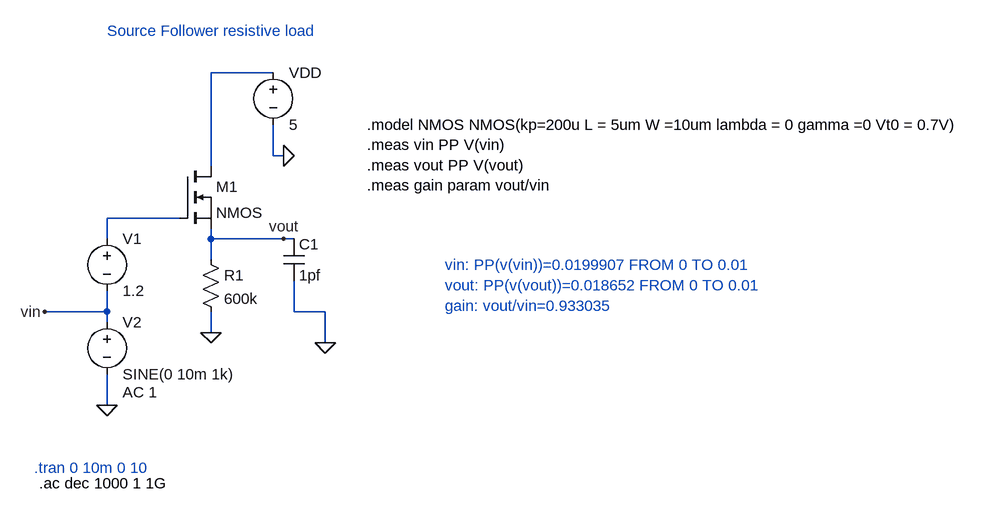
[diagram p0: schematic Source_follower_res_load.asc]
Source_follower_res_load.asc, the LTspice schematic file:
Version 4
SHEET 1 1404 680
WIRE 256 -64 160 -64
WIRE 256 64 256 16
WIRE 272 64 256 64
WIRE 160 80 160 -64
WIRE 112 160 0 160
WIRE 0 192 0 160
WIRE 160 192 160 176
WIRE 272 192 160 192
WIRE 288 192 272 192
WIRE 160 224 160 192
WIRE 0 304 0 272
WIRE 0 304 -96 304
WIRE 288 304 288 256
WIRE 336 304 288 304
WIRE 0 320 0 304
WIRE 160 336 160 304
WIRE 336 352 336 304
WIRE 0 448 0 400
FLAG 272 64 0
FLAG 160 336 0
FLAG 0 448 0
FLAG -96 304 vin
FLAG 336 352 0
FLAG 272 192 vout
SYMBOL nmos 112 80 R0
SYMATTR InstName M1
SYMBOL res 144 208 R0
SYMATTR InstName R1
SYMATTR Value 600k
SYMBOL cap 272 192 R0
SYMATTR InstName C1
SYMATTR Value 1pf
SYMBOL voltage 0 176 R0
WINDOW 123 0 0 Left 0
WINDOW 39 0 0 Left 0
SYMATTR InstName V1
SYMATTR Value 1.2
SYMBOL voltage 0 304 R0
WINDOW 123 24 124 Left 2
WINDOW 39 0 0 Left 0
SYMATTR Value2 AC 1
SYMATTR InstName V2
SYMATTR Value SINE(0 10m 1k)
SYMBOL voltage 256 -80 R0
WINDOW 123 0 0 Left 0
WINDOW 39 0 0 Left 0
SYMATTR InstName VDD
SYMATTR Value 5
TEXT 400 16 Left 2 !.model NMOS NMOS(kp=200u L = 5um W =10um lambda = 0 gamma =0 Vt0 = 0.7V)\n.meas vin PP V(vin)\n.meas vout PP V(vout)\n.meas gain param vout/vin
TEXT -112 544 Left 2 ;.tran 0 10m 0 10
TEXT 520 232 Left 2 ;vin: PP(v(vin))=0.0199907 FROM 0 TO 0.01\nvout: PP(v(vout))=0.018652 FROM 0 TO 0.01\ngain: vout/vin=0.933035
TEXT 0 -128 Left 2 ;Source Follower resistive load
TEXT -104 568 Left 2 !.ac dec 1000 1 1G

The netlist it stands for:
* Source_follower_res_load.asc
M1 N001 N002 vout vout NMOS
R1 vout 0 600k
C1 vout 0 1pf
V1 N002 vin 1.2
V2 vin 0 SINE(0 10m 1k) AC 1
VDD N001 0 5
.model NMOS NMOS
.model PMOS PMOS
.lib standard.mos
.model NMOS NMOS(kp=200u L = 5um W =10um lambda = 0 gamma =0 Vt0 = 0.7V)
.meas vin PP V(vin)
.meas vout PP V(vout)
.meas gain param vout/vin
* .tran 0 10m 0 10
* vin: PP(v(vin))=0.0199907 FROM 0 TO 0.01
* vout: PP(v(vout))=0.018652 FROM 0 TO 0.01
* gain: vout/vin=0.933035
* Source Follower resistive load
.ac dec 1000 1 1G
.backanno
.end